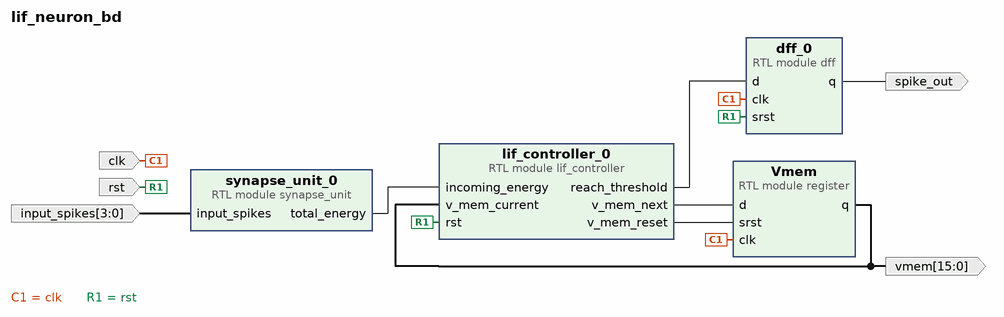
[diagram p0: block diagram of the top level]
# Vivado block design lif_neuron_bd, xc7z020clg400-1, Vivado 2025.2
create_bd_design lif_neuron_bd

create_bd_port -dir I -from 3 -to 0 input_spikes
create_bd_port -dir I rst
create_bd_port -dir I clk
create_bd_port -dir O spike_out
create_bd_port -dir O -from 15 -to 0 -type data vmem

create_bd_cell -type module -reference synapse_unit synapse_unit_0
create_bd_cell -type module -reference dff dff_0
create_bd_cell -type module -reference lif_controller lif_controller_0
create_bd_cell -type module -reference register Vmem

# ---- connections ----

connect_bd_net [get_bd_pins Vmem/q] [get_bd_ports vmem] [get_bd_pins lif_controller_0/v_mem_current]
connect_bd_net [get_bd_ports clk] [get_bd_pins dff_0/clk] [get_bd_pins Vmem/clk]
connect_bd_net [get_bd_pins dff_0/q] [get_bd_ports spike_out]
connect_bd_net [get_bd_ports input_spikes] [get_bd_pins synapse_unit_0/input_spikes]
connect_bd_net -net lif_controller_0_spike_now [get_bd_pins lif_controller_0/reach_threshold] [get_bd_pins dff_0/d]
connect_bd_net [get_bd_pins lif_controller_0/v_mem_next] [get_bd_pins Vmem/d]
connect_bd_net [get_bd_pins lif_controller_0/v_mem_reset] [get_bd_pins Vmem/srst]
connect_bd_net -net srst_1 [get_bd_ports rst] [get_bd_pins dff_0/srst] [get_bd_pins lif_controller_0/rst]
connect_bd_net [get_bd_pins synapse_unit_0/total_energy] [get_bd_pins lif_controller_0/incoming_energy]

validate_bd_design
save_bd_design
